# Altium schematic sheet Filter4.SchDoc
size 420 x 297 mm; SheetNumber: 9; SheetTotal: 13
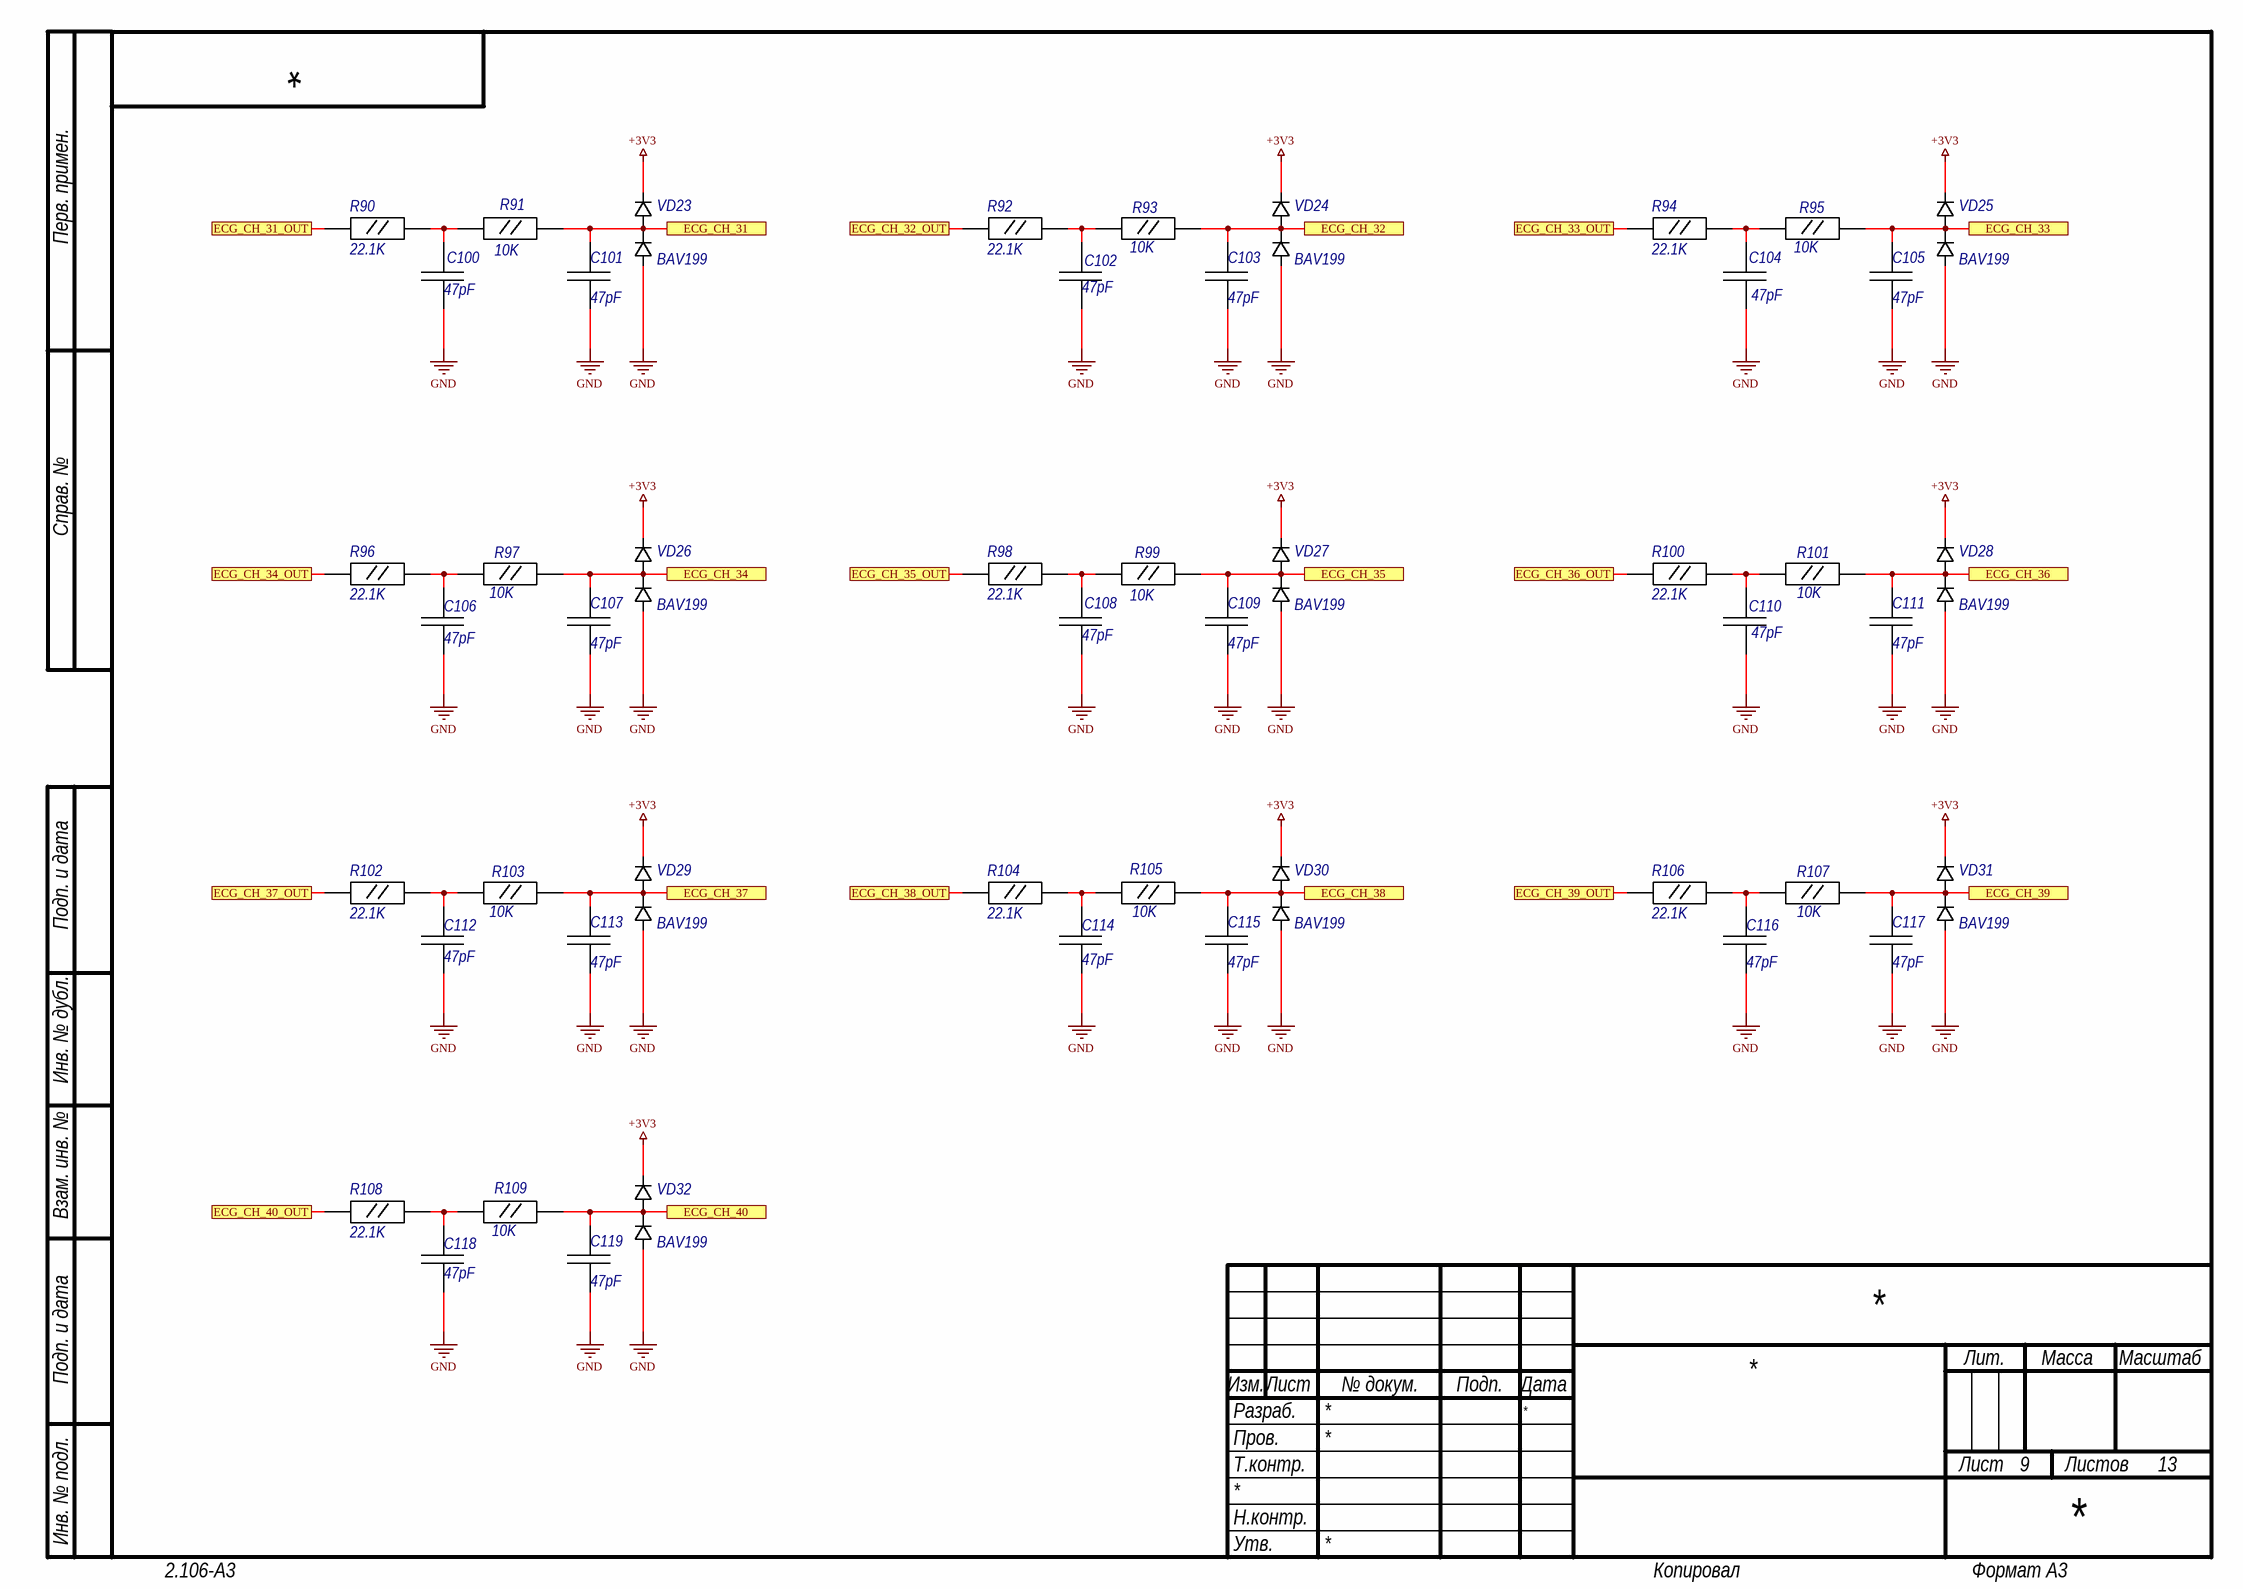
[diagram p0: Filter4.SchDoc]

## Parts
C100  47pF  [C0603]
C101  47pF  [C0603]
C102  47pF  [C0603]
C103  47pF  [C0603]
C104  47pF  [C0603]
C105  47pF  [C0603]
C106  47pF  [C0603]
C107  47pF  [C0603]
C108  47pF  [C0603]
C109  47pF  [C0603]
C110  47pF  [C0603]
C111  47pF  [C0603]
C112  47pF  [C0603]
C113  47pF  [C0603]
C114  47pF  [C0603]
C115  47pF  [C0603]
C116  47pF  [C0603]
C117  47pF  [C0603]
C118  47pF  [C0603]
C119  47pF  [C0603]
R90  22.1K  [R0603]
R91  10K  [R0603]
R92  22.1K  [R0603]
R93  10K  [R0603]
R94  22.1K  [R0603]
R95  10K  [R0603]
R96  22.1K  [R0603]
R97  10K  [R0603]
R98  22.1K  [R0603]
R99  10K  [R0603]
R100  22.1K  [R0603]
R101  10K  [R0603]
R102  22.1K  [R0603]
R103  10K  [R0603]
R104  22.1K  [R0603]
R105  10K  [R0603]
R106  22.1K  [R0603]
R107  10K  [R0603]
R108  22.1K  [R0603]
R109  10K  [R0603]
VD23  BAV199  [SOT23]
VD24  BAV199  [SOT23]
VD25  BAV199  [SOT23]
VD26  BAV199  [SOT23]
VD27  BAV199  [SOT23]
VD28  BAV199  [SOT23]
VD29  BAV199  [SOT23]
VD30  BAV199  [SOT23]
VD31  BAV199  [SOT23]
VD32  BAV199  [SOT23]

## Ports
ECG_CH_31, ECG_CH_31_OUT, ECG_CH_32, ECG_CH_32_OUT, ECG_CH_33, ECG_CH_33_OUT, ECG_CH_34, ECG_CH_34_OUT, ECG_CH_35, ECG_CH_35_OUT, ECG_CH_36, ECG_CH_36_OUT, ECG_CH_37, ECG_CH_37_OUT, ECG_CH_38, ECG_CH_38_OUT, ECG_CH_39, ECG_CH_39_OUT, ECG_CH_40, ECG_CH_40_OUT

## Nets
+3V3: VD23.2 VD24.2 VD25.2 VD26.2 VD27.2 VD28.2 VD29.2 VD30.2 VD31.2 VD32.2
GND: C100.1 C101.1 C102.1 C103.1 C104.1 C105.1 C106.1 C107.1 C108.1 C109.1 C110.1 C111.1 C112.1 C113.1 C114.1 C115.1 C116.1 C117.1 C118.1 C119.1 VD23.1 VD24.1 VD25.1 VD26.1 VD27.1 VD28.1 VD29.1 VD30.1 VD31.1 VD32.1
ECG_CH_31: C101.2 R91.2 VD23.3 ; port ECG_CH_31
ECG_CH_31_OUT: R90.1 ; port ECG_CH_31_OUT
ECG_CH_32: C103.2 R93.2 VD24.3 ; port ECG_CH_32
ECG_CH_32_OUT: R92.1 ; port ECG_CH_32_OUT
ECG_CH_33: C105.2 R95.2 VD25.3 ; port ECG_CH_33
ECG_CH_33_OUT: R94.1 ; port ECG_CH_33_OUT
ECG_CH_34: C107.2 R97.2 VD26.3 ; port ECG_CH_34
ECG_CH_34_OUT: R96.1 ; port ECG_CH_34_OUT
ECG_CH_35: C109.2 R99.2 VD27.3 ; port ECG_CH_35
ECG_CH_35_OUT: R98.1 ; port ECG_CH_35_OUT
ECG_CH_36: C111.2 R101.2 VD28.3 ; port ECG_CH_36
ECG_CH_36_OUT: R100.1 ; port ECG_CH_36_OUT
ECG_CH_37: C113.2 R103.2 VD29.3 ; port ECG_CH_37
ECG_CH_37_OUT: R102.1 ; port ECG_CH_37_OUT
ECG_CH_38: C115.2 R105.2 VD30.3 ; port ECG_CH_38
ECG_CH_38_OUT: R104.1 ; port ECG_CH_38_OUT
ECG_CH_39: C117.2 R107.2 VD31.3 ; port ECG_CH_39
ECG_CH_39_OUT: R106.1 ; port ECG_CH_39_OUT
ECG_CH_40: C119.2 R109.2 VD32.3 ; port ECG_CH_40
ECG_CH_40_OUT: R108.1 ; port ECG_CH_40_OUT
NetC100_2: C100.2 R90.2 R91.1
NetC102_2: C102.2 R92.2 R93.1
NetC104_2: C104.2 R94.2 R95.1
NetC106_2: C106.2 R96.2 R97.1
NetC108_2: C108.2 R98.2 R99.1
NetC110_2: C110.2 R100.2 R101.1
NetC112_2: C112.2 R102.2 R103.1
NetC114_2: C114.2 R104.2 R105.1
NetC116_2: C116.2 R106.2 R107.1
NetC118_2: C118.2 R108.2 R109.1

## Notes on the sheet
- Перв. примен.
- Справ. №
- Подп. и дата
- Инв. № дубл.
- Взам. инв. №
- Разраб.
- Изм.
- Лист
- № докум.
- Подп.
- Дата
- Лит.
- Масса
- Масштаб
- Пров.
- Т.контр.
- Листов
- Инв. № подл.
- Утв.
- Н.контр.
- 2.106-A3
- Копировал
- Формат А3

## Library data of the parts
C100-C119 = CC_SMD_0603: Ceramic Capacitor SMD; Package: 0603; Value: 47pF
R90-R109 = R0603: Resistor SMD
  R90 R92 R94 R96 R98 R100 R102 R104 R106 R108: Value: 22.1K
  R91 R93 R95 R97 R99 R101 R103 R105 R107 R109: Value: 10K
VD23-VD32 = DIODE_BAV199: Diod Schottky; Diode Type: Standard; Package: SOT-23; PartNumber: BAV199; Manufacturer Part Number 1: BAV199